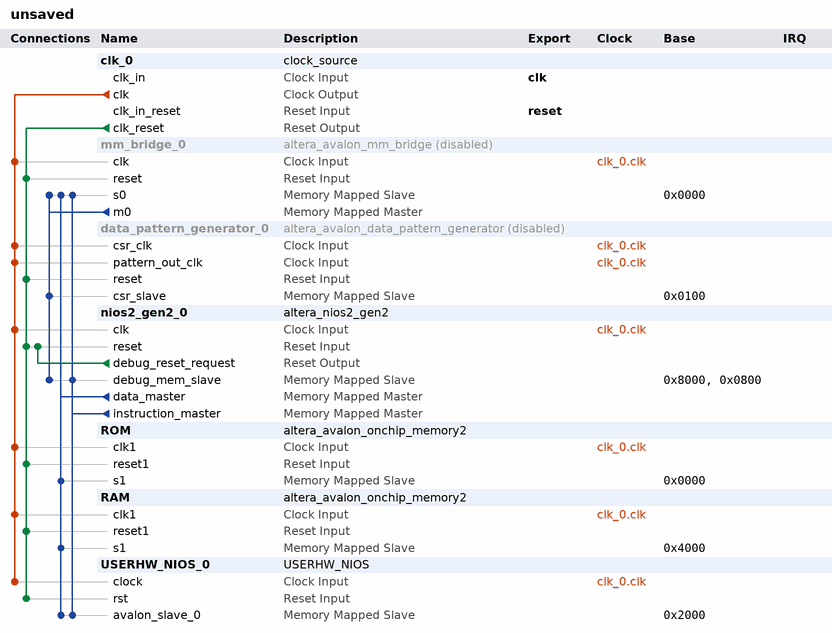
[diagram p0: system contents]
# Platform Designer (Qsys) system unsaved, Cyclone 10 LP 10CL025YU256I7G
# Parameters at their usual value, and those the tool derives, are not listed.
package require -exact qsys 21.1
create_system unsaved
set_project_property DEVICE_FAMILY {Cyclone 10 LP}
set_project_property DEVICE 10CL025YU256I7G

add_instance clk_0 clock_source 21.1
set_instance_parameter_value clk_0 clockFrequency 50000000

add_instance mm_bridge_0 altera_avalon_mm_bridge 21.1
set_instance_property mm_bridge_0 ENABLED false
set_instance_parameter_value mm_bridge_0 ADDRESS_UNITS SYMBOLS
set_instance_parameter_value mm_bridge_0 ADDRESS_WIDTH 10
set_instance_parameter_value mm_bridge_0 DATA_WIDTH 32
set_instance_parameter_value mm_bridge_0 MAX_PENDING_RESPONSES 4
set_instance_parameter_value mm_bridge_0 USE_AUTO_ADDRESS_WIDTH 0

add_instance data_pattern_generator_0 altera_avalon_data_pattern_generator 21.1
set_instance_property data_pattern_generator_0 ENABLED false
set_instance_parameter_value data_pattern_generator_0 AVALON_ENABLED true
set_instance_parameter_value data_pattern_generator_0 BYPASS_ENABLED false
set_instance_parameter_value data_pattern_generator_0 CROSS_CLK_SYNC_DEPTH 2
set_instance_parameter_value data_pattern_generator_0 FREQ_CNTER_ENABLED false
set_instance_parameter_value data_pattern_generator_0 ST_DATA_W 32

add_instance nios2_gen2_0 altera_nios2_gen2 21.1
set_instance_parameter_value nios2_gen2_0 dcache_size 2048
set_instance_parameter_value nios2_gen2_0 exceptionSlave Absolute
set_instance_parameter_value nios2_gen2_0 icache_size 1024
set_instance_parameter_value nios2_gen2_0 impl Fast
set_instance_parameter_value nios2_gen2_0 resetSlave Absolute

add_instance ROM altera_avalon_onchip_memory2 21.1
set_instance_parameter_value ROM dataWidth 32
set_instance_parameter_value ROM dualPort false
set_instance_parameter_value ROM initMemContent true
set_instance_parameter_value ROM initializationFileName onchip_mem.hex
set_instance_parameter_value ROM memorySize 8182
set_instance_parameter_value ROM writable false

add_instance RAM altera_avalon_onchip_memory2 21.1
set_instance_parameter_value RAM dataWidth 32
set_instance_parameter_value RAM dualPort false
set_instance_parameter_value RAM initMemContent true
set_instance_parameter_value RAM initializationFileName onchip_mem.hex
set_instance_parameter_value RAM memorySize 8182

add_instance USERHW_NIOS_0 USERHW_NIOS 1.0

# connections
add_connection clk_0.clk data_pattern_generator_0.csr_clk clock
add_connection clk_0.clk data_pattern_generator_0.pattern_out_clk clock
add_connection clk_0.clk mm_bridge_0.clk clock
add_connection clk_0.clk nios2_gen2_0.clk clock
add_connection clk_0.clk RAM.clk1 clock
add_connection clk_0.clk ROM.clk1 clock
add_connection clk_0.clk USERHW_NIOS_0.clock clock
add_connection clk_0.clk_reset data_pattern_generator_0.reset reset
add_connection clk_0.clk_reset mm_bridge_0.reset reset
add_connection clk_0.clk_reset nios2_gen2_0.reset reset
add_connection clk_0.clk_reset RAM.reset1 reset
add_connection clk_0.clk_reset ROM.reset1 reset
add_connection clk_0.clk_reset USERHW_NIOS_0.rst reset
add_connection nios2_gen2_0.debug_reset_request nios2_gen2_0.reset reset
add_connection mm_bridge_0.m0 data_pattern_generator_0.csr_slave avalon
set_connection_parameter_value mm_bridge_0.m0/data_pattern_generator_0.csr_slave baseAddress 0x0100
add_connection mm_bridge_0.m0 mm_bridge_0.s0 avalon
set_connection_parameter_value mm_bridge_0.m0/mm_bridge_0.s0 baseAddress 0x0000
add_connection mm_bridge_0.m0 nios2_gen2_0.debug_mem_slave avalon
set_connection_parameter_value mm_bridge_0.m0/nios2_gen2_0.debug_mem_slave baseAddress 0x0800
add_connection nios2_gen2_0.data_master mm_bridge_0.s0 avalon
set_connection_parameter_value nios2_gen2_0.data_master/mm_bridge_0.s0 baseAddress 0x0000
add_connection nios2_gen2_0.data_master RAM.s1 avalon
set_connection_parameter_value nios2_gen2_0.data_master/RAM.s1 baseAddress 0x4000
add_connection nios2_gen2_0.data_master ROM.s1 avalon
set_connection_parameter_value nios2_gen2_0.data_master/ROM.s1 baseAddress 0x0000
add_connection nios2_gen2_0.data_master USERHW_NIOS_0.avalon_slave_0 avalon
set_connection_parameter_value nios2_gen2_0.data_master/USERHW_NIOS_0.avalon_slave_0 baseAddress 0x2000
add_connection nios2_gen2_0.instruction_master mm_bridge_0.s0 avalon
set_connection_parameter_value nios2_gen2_0.instruction_master/mm_bridge_0.s0 baseAddress 0x0000
add_connection nios2_gen2_0.instruction_master nios2_gen2_0.debug_mem_slave avalon
set_connection_parameter_value nios2_gen2_0.instruction_master/nios2_gen2_0.debug_mem_slave baseAddress 0x8000
add_connection nios2_gen2_0.instruction_master USERHW_NIOS_0.avalon_slave_0 avalon
set_connection_parameter_value nios2_gen2_0.instruction_master/USERHW_NIOS_0.avalon_slave_0 baseAddress 0x2000

# exported interfaces
add_interface clk clock sink
set_interface_property clk EXPORT_OF clk_0.clk_in
add_interface reset reset sink
set_interface_property reset EXPORT_OF clk_0.clk_in_reset

set_interconnect_requirement {$system} qsys_mm.clockCrossingAdapter HANDSHAKE
set_interconnect_requirement {$system} qsys_mm.enableEccProtection FALSE
set_interconnect_requirement {$system} qsys_mm.insertDefaultSlave FALSE
set_interconnect_requirement {$system} qsys_mm.maxAdditionalLatency 1

save_system unsaved.qsys
